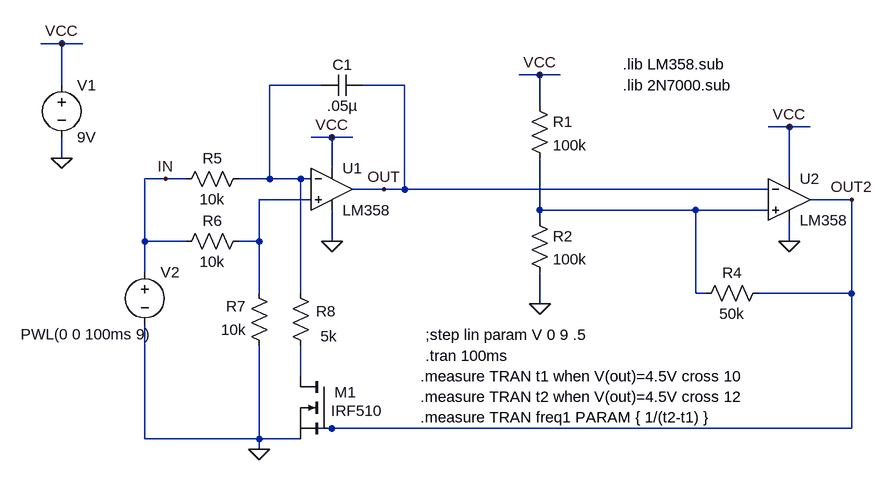
[diagram p0: schematic VoltageControlledOscillator.asc]
VoltageControlledOscillator.asc, the LTspice schematic file:
Version 4
SHEET 1 1464 740
WIRE -352 -64 -384 -64
WIRE -320 -64 -352 -64
WIRE 384 -16 352 -16
WIRE 416 -16 384 -16
WIRE -352 0 -352 -64
WIRE 48 0 -32 0
WIRE 176 0 112 0
WIRE 384 32 384 -16
WIRE 768 64 736 64
WIRE 800 64 768 64
WIRE 64 80 32 80
WIRE 96 80 64 80
WIRE -352 112 -352 80
WIRE 64 128 64 80
WIRE -192 144 -224 144
WIRE -160 144 -192 144
WIRE -32 144 -32 0
WIRE -32 144 -80 144
WIRE 16 144 -32 144
WIRE 32 144 16 144
WIRE 768 144 768 64
WIRE 144 160 96 160
WIRE 176 160 176 0
WIRE 176 160 144 160
WIRE 736 160 176 160
WIRE 32 176 -48 176
WIRE 864 176 800 176
WIRE 384 192 384 112
WIRE 624 192 384 192
WIRE 736 192 624 192
WIRE 384 208 384 192
WIRE -224 240 -224 144
WIRE -160 240 -224 240
WIRE -48 240 -48 176
WIRE -48 240 -80 240
WIRE 64 240 64 192
WIRE 768 240 768 208
WIRE -224 288 -224 240
WIRE -48 320 -48 240
WIRE 16 320 16 144
WIRE 624 320 624 192
WIRE 640 320 624 320
WIRE 864 320 864 176
WIRE 864 320 720 320
WIRE 384 336 384 288
WIRE 16 448 16 400
WIRE 64 528 16 528
WIRE 864 528 864 320
WIRE 864 528 64 528
WIRE -224 544 -224 368
WIRE -48 544 -48 400
WIRE -48 544 -224 544
WIRE 16 544 -48 544
WIRE -48 560 -48 544
FLAG -352 112 0
FLAG 384 336 0
FLAG -48 560 0
FLAG 64 240 0
FLAG 768 240 0
FLAG 144 160 OUT
FLAG 864 176 OUT2
FLAG -192 144 IN
FLAG -352 -64 VCC
FLAG 64 80 VCC
FLAG 384 -16 VCC
FLAG 768 64 VCC
SYMBOL voltage -352 -16 R0
WINDOW 123 0 0 Left 2
WINDOW 39 0 0 Left 2
SYMATTR InstName V1
SYMATTR Value 9V
SYMBOL res 368 16 R0
SYMATTR InstName R1
SYMATTR Value 100k
SYMBOL res 368 192 R0
SYMATTR InstName R2
SYMATTR Value 100k
SYMBOL res 736 304 R90
WINDOW 0 0 56 VBottom 2
WINDOW 3 32 56 VTop 2
SYMATTR InstName R4
SYMATTR Value 50k
SYMBOL res -64 128 R90
WINDOW 0 0 56 VBottom 2
WINDOW 3 32 56 VTop 2
SYMATTR InstName R5
SYMATTR Value 10k
SYMBOL res -64 224 R90
WINDOW 0 0 56 VBottom 2
WINDOW 3 32 56 VTop 2
SYMATTR InstName R6
SYMATTR Value 10k
SYMBOL res -32 416 R180
WINDOW 0 36 76 Left 2
WINDOW 3 36 40 Left 2
SYMATTR InstName R7
SYMATTR Value 10k
SYMBOL res 32 416 R180
WINDOW 0 -38 68 Left 2
WINDOW 3 -40 30 Left 2
SYMATTR InstName R8
SYMATTR Value 5k
SYMBOL voltage -224 272 R0
WINDOW 123 0 0 Left 2
WINDOW 39 0 0 Left 2
WINDOW 3 -191 111 Left 2
SYMATTR Value PWL(0 0 100ms 9)
SYMATTR InstName V2
SYMBOL cap 112 -16 R90
WINDOW 0 0 32 VBottom 2
WINDOW 3 32 32 VTop 2
SYMATTR InstName C1
SYMATTR Value .05µ
SYMATTR SpiceLine V=50 Irms=10.158 Rser=1 Lser=0
SYMBOL Opamps\\opamp2 64 96 R0
SYMATTR InstName U1
SYMATTR Value LM358
SYMBOL Opamps\\opamp2 768 112 R0
SYMATTR InstName U2
SYMATTR Value LM358
SYMBOL nmos 64 448 M0
WINDOW 0 -38 24 Left 2
WINDOW 3 -78 53 Left 2
SYMATTR InstName M1
SYMATTR Value IRF510
TEXT 208 416 Left 2 !.tran 100ms
TEXT 208 384 Left 2 !;step lin param V 0 9 .5
TEXT 200 448 Left 2 !.measure TRAN t1 when V(out)=4.5V cross 10\n.measure TRAN t2 when V(out)=4.5V cross 12\n.measure TRAN freq1 PARAM { 1/(t2-t1) }
TEXT 512 0 Left 2 !.lib 2N7000.sub
TEXT 512 -32 Left 2 !.lib LM358.sub

The netlist it stands for:
* VoltageControlledOscillator.asc
V1 VCC 0 9V
R1 VCC N003 100k
R2 N003 0 100k
R4 OUT2 N003 50k
R5 N001 IN 10k
R6 N002 IN 10k
R7 0 N002 10k
R8 N004 N001 5k
V2 IN 0 PWL(0 0 100ms 9)
C1 OUT N001 .05µ V=50 Irms=10.158 Rser=1 Lser=0
XU1 N002 N001 VCC 0 OUT LM358  ; pins In+ In- V+ V- OUT
XU2 N003 OUT VCC 0 OUT2 LM358  ; pins In+ In- V+ V- OUT
M1 N004 OUT2 0 0 IRF510
.model NMOS NMOS
.model PMOS PMOS
.lib standard.mos
.tran 100ms
;step lin param V 0 9 .5
.measure TRAN t1 when V(out)=4.5V cross 10
.measure TRAN t2 when V(out)=4.5V cross 12
.measure TRAN freq1 PARAM { 1/(t2-t1) }
.lib 2N7000.sub
.lib LM358.sub
.backanno
.end